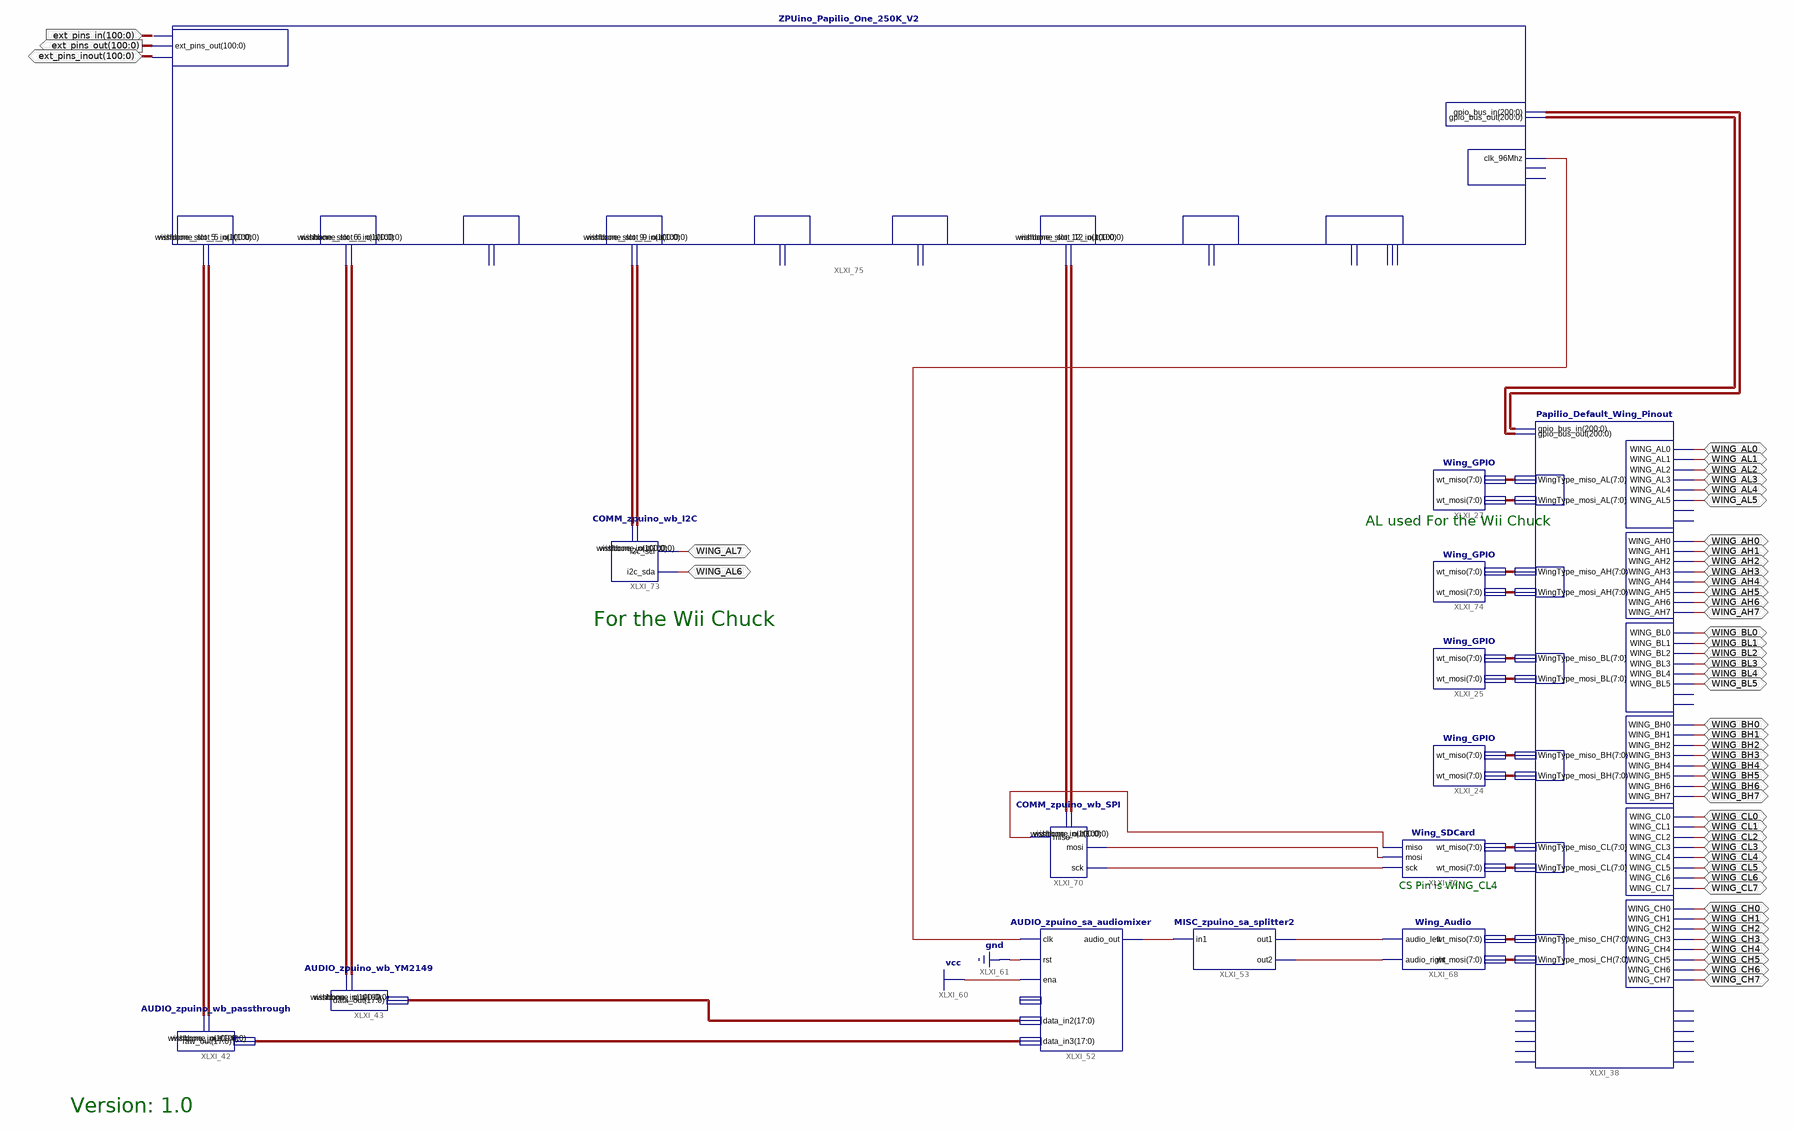
[diagram p0: schematic sheet 1]
// Xilinx ISE schematic Papilio_One_250K.sch (spartan3e) as structural Verilog: 14 symbols, 49 ports
module Papilio_One_250K (
  input  [100:0] ext_pins_in,
  inout  WING_AL0,
  inout  WING_AL1,
  inout  WING_AL2,
  inout  WING_AL3,
  inout  WING_AL4,
  inout  WING_AL5,
  inout  WING_AL6,
  inout  WING_AL7,
  inout  WING_AH0,
  inout  WING_AH1,
  inout  WING_AH2,
  inout  WING_AH3,
  inout  WING_AH4,
  inout  WING_AH5,
  inout  WING_AH6,
  inout  WING_AH7,
  inout  WING_BL0,
  inout  WING_BL1,
  inout  WING_BL2,
  inout  WING_BL3,
  inout  WING_BL4,
  inout  WING_BL5,
  inout  WING_BH0,
  inout  WING_BH1,
  inout  WING_BH2,
  inout  WING_BH3,
  inout  WING_BH4,
  inout  WING_BH5,
  inout  WING_BH6,
  inout  WING_BH7,
  inout  WING_CL0,
  inout  WING_CL1,
  inout  WING_CL2,
  inout  WING_CL3,
  inout  WING_CL4,
  inout  WING_CL5,
  inout  WING_CL6,
  inout  WING_CL7,
  inout  WING_CH0,
  inout  WING_CH1,
  inout  WING_CH2,
  inout  WING_CH3,
  inout  WING_CH4,
  inout  WING_CH5,
  inout  WING_CH6,
  inout  WING_CH7,
  inout  [100:0] ext_pins_inout,
  output [100:0] ext_pins_out
);

  wire XLXN_456, XLXN_521, XLXN_522, XLXN_531, XLXN_550, XLXN_551, XLXN_552;
  wire [7:0] XLXN_329, XLXN_330, XLXN_331, XLXN_332, XLXN_335, XLXN_336, XLXN_486, XLXN_487, XLXN_547,
       XLXN_548, XLXN_553, XLXN_554;
  wire [17:0] XLXN_467, XLXN_468;
  wire [100:0] XLXN_450, XLXN_451, XLXN_452, XLXN_453, XLXN_536, XLXN_537, XLXN_563, XLXN_564;
  wire [200:0] XLXN_408, XLXN_409;

  Wing_GPIO XLXI_27 (.wt_miso(XLXN_335), .wt_mosi(XLXN_336));
  Wing_GPIO XLXI_25 (.wt_miso(XLXN_331), .wt_mosi(XLXN_332));
  Wing_GPIO XLXI_24 (.wt_miso(XLXN_329), .wt_mosi(XLXN_330));
  Papilio_Default_Wing_Pinout XLXI_38 (
    .WING_AH0(WING_AH0), .WING_AH1(WING_AH1), .WING_AH2(WING_AH2), .WING_AH3(WING_AH3), .WING_AH4(WING_AH4),
    .WING_AH5(WING_AH5), .WING_AH6(WING_AH6), .WING_AH7(WING_AH7), .WING_AL0(WING_AL0), .WING_AL1(WING_AL1),
    .WING_AL2(WING_AL2), .WING_AL3(WING_AL3), .WING_AL4(WING_AL4), .WING_AL5(WING_AL5), .WING_BH0(WING_BH0),
    .WING_BH1(WING_BH1), .WING_BH2(WING_BH2), .WING_BH3(WING_BH3), .WING_BH4(WING_BH4), .WING_BH5(WING_BH5),
    .WING_BH6(WING_BH6), .WING_BH7(WING_BH7), .WING_BL0(WING_BL0), .WING_BL1(WING_BL1), .WING_BL2(WING_BL2),
    .WING_BL3(WING_BL3), .WING_BL4(WING_BL4), .WING_BL5(WING_BL5), .WING_CL0(WING_CL0), .WING_CL1(WING_CL1),
    .WING_CL2(WING_CL2), .WING_CL3(WING_CL3), .WING_CL4(WING_CL4), .WING_CL5(WING_CL5), .WING_CL6(WING_CL6),
    .WING_CL7(WING_CL7), .WING_CH0(WING_CH0), .WING_CH1(WING_CH1), .WING_CH2(WING_CH2), .WING_CH3(WING_CH3),
    .WING_CH4(WING_CH4), .WING_CH5(WING_CH5), .WING_CH6(WING_CH6), .WING_CH7(WING_CH7),
    .gpio_bus_out(XLXN_408), .gpio_bus_in(XLXN_409), .WingType_miso_BH(XLXN_329),
    .WingType_miso_BL(XLXN_331), .WingType_miso_AH(XLXN_553), .WingType_mosi_BL(XLXN_332),
    .WingType_mosi_BH(XLXN_330), .WingType_mosi_CL(XLXN_548), .WingType_mosi_AH(XLXN_554),
    .WingType_miso_CL(XLXN_547), .WingType_miso_CH(XLXN_486), .WingType_mosi_CH(XLXN_487),
    .WingType_mosi_AL(XLXN_336), .WingType_miso_AL(XLXN_335));  // open: WING_AL6, WING_AL7, WING_BL6, WING_BL7, Flex_Pin_out_0, Flex_Pin_out_1, Flex_Pin_out_2, Flex_Pin_out_3, Flex_Pin_out_4, Flex_Pin_out_5, Flex_Pin_in_0, Flex_Pin_in_1, Flex_Pin_in_2, Flex_Pin_in_3, Flex_Pin_in_4, Flex_Pin_in_5
  Wing_Audio XLXI_68 (.audio_left(XLXN_521), .audio_right(XLXN_522), .wt_miso(XLXN_486), .wt_mosi(XLXN_487));
  MISC_zpuino_sa_splitter2 XLXI_53 (.in1(XLXN_456), .out1(XLXN_521), .out2(XLXN_522));
  AUDIO_zpuino_sa_audiomixer XLXI_52 (
    .clk(XLXN_531), .rst(1'b0), .ena(1'b1), .data_in2(XLXN_468), .data_in3(XLXN_467), .audio_out(XLXN_456));  // open: data_in1
  AUDIO_zpuino_wb_YM2149 XLXI_43 (.data_out(XLXN_468), .wishbone_in(XLXN_452), .wishbone_out(XLXN_453));
  AUDIO_zpuino_wb_passthrough XLXI_42 (.raw_out(XLXN_467), .wishbone_in(XLXN_450), .wishbone_out(XLXN_451));
  COMM_zpuino_wb_SPI XLXI_70 (
    .miso(XLXN_552), .sck(XLXN_550), .mosi(XLXN_551), .wishbone_in(XLXN_536), .wishbone_out(XLXN_537));
  Wing_SDCard XLXI_72 (.wt_miso(XLXN_547), .wt_mosi(XLXN_548), .sck(XLXN_550), .mosi(XLXN_551), .miso(XLXN_552));
  Wing_GPIO XLXI_74 (.wt_miso(XLXN_553), .wt_mosi(XLXN_554));
  ZPUino_Papilio_One_250K_V2 XLXI_75 (
    .clk_96Mhz(XLXN_531), .ext_pins_in(ext_pins_in), .ext_pins_out(ext_pins_out),
    .ext_pins_inout(ext_pins_inout), .gpio_bus_out(XLXN_408), .gpio_bus_in(XLXN_409),
    .wishbone_slot_5_out(XLXN_451), .wishbone_slot_5_in(XLXN_450), .wishbone_slot_6_in(XLXN_452),
    .wishbone_slot_6_out(XLXN_453), .wishbone_slot_9_in(XLXN_563), .wishbone_slot_9_out(XLXN_564),
    .wishbone_slot_12_in(XLXN_536), .wishbone_slot_12_out(XLXN_537));  // open: clk_1Mhz, clk_osc_32Mhz, wishbone_slot_8_in, wishbone_slot_8_out, wishbone_slot_10_in, wishbone_slot_10_out, wishbone_slot_11_in, wishbone_slot_11_out, wishbone_slot_13_in, wishbone_slot_13_out, wishbone_slot_14_in, wishbone_slot_14_out, wishbone_slot_video_in, wishbone_slot_video_out, vgaclkout
  COMM_zpuino_wb_I2C XLXI_73 (.i2c_scl(WING_AL7), .i2c_sda(WING_AL6), .wishbone_in(XLXN_563), .wishbone_out(XLXN_564));

  // Notes on the sheet:
  //   AL used For the Wii Chuck
  //   For the Wii Chuck
  //   CS Pin is WING_CL4
  //   Version: 1.0
endmodule
